# Altium schematic sheet Mach dieu khien dong co dc luu tru.SchDoc
size A4
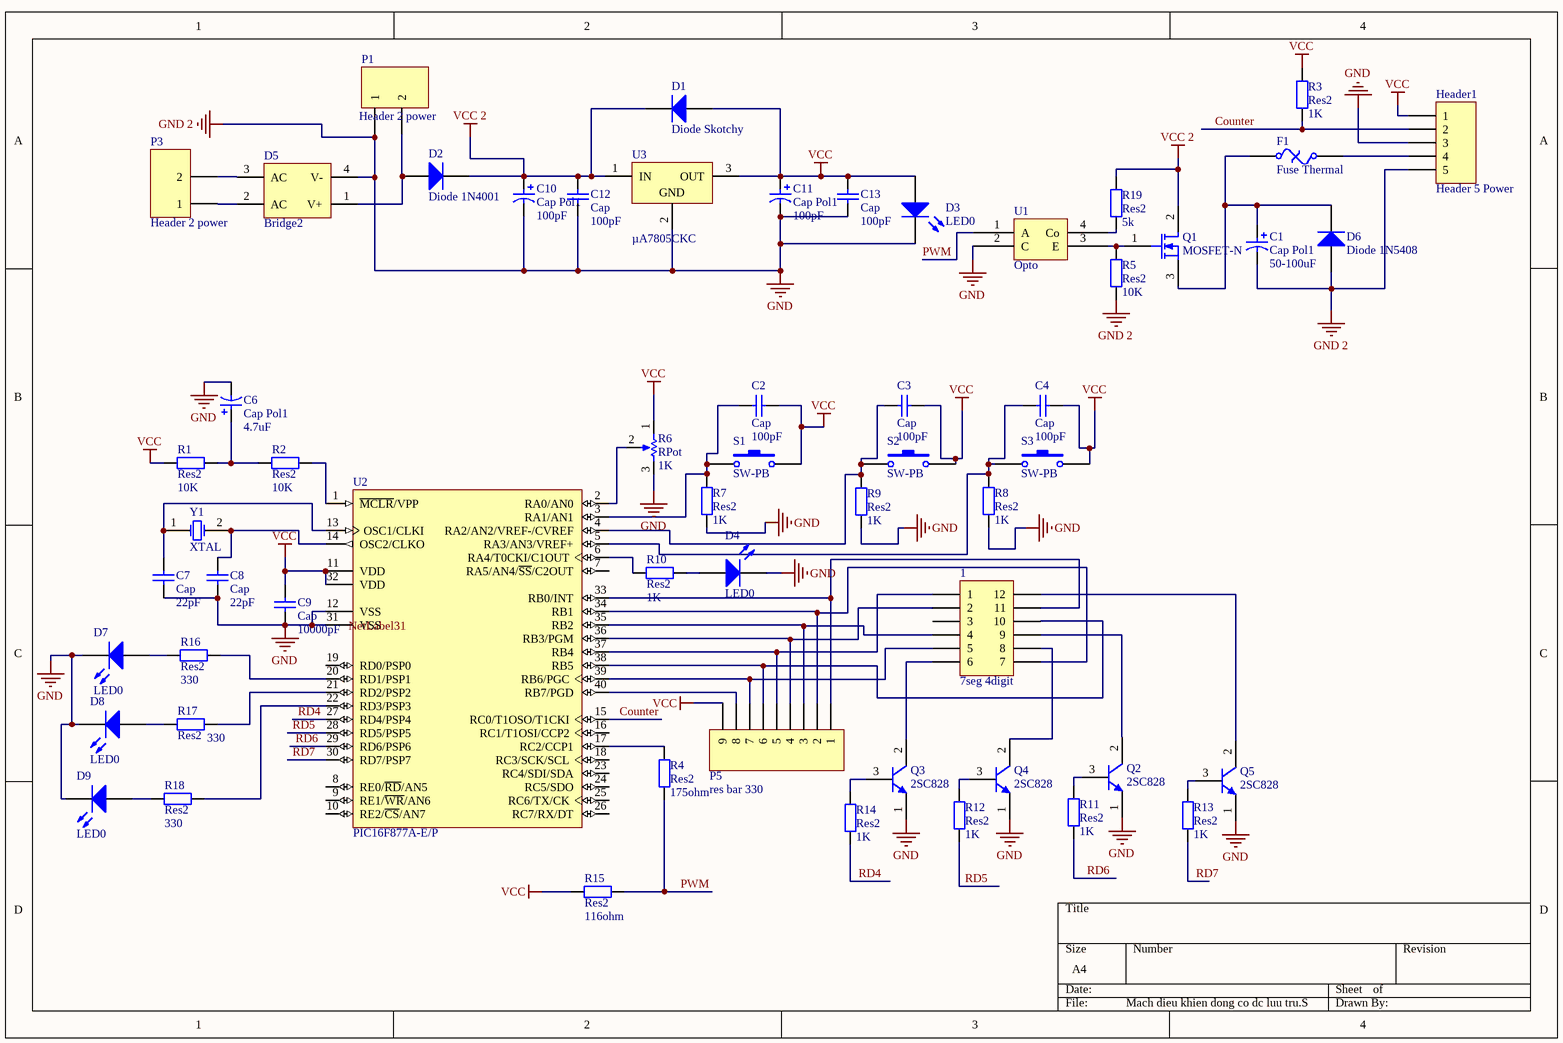
[diagram p0: Mach dieu khien dong co dc luu tru.SchDoc]

## Parts
1  7seg 4digit  [LEDDIP-12/QUAD]
C1  Cap Pol1  value 50-100uF  [CAPPR5-5x7]
C2  Cap  value 100pF  [CAPNTO3.18-4.83x2.67]
C3  Cap  value 100pF  [CAPNTO3.18-4.83x2.67]
C4  Cap  value 100pF  [CAPNTO3.18-4.83x2.67]
C6  Cap Pol1  value 4.7uF  [CAPPR2-5x15]
C7  Cap  value 22pF  [CAPNTO3.18-4.83x2.67]
C8  Cap  value 22pF  [CAPNTO3.18-4.83x2.67]
C9  Cap  value 10000pF  [CAPNTO3.18-4.83x2.67]
C10  Cap Pol1  value 100pF  [CAPPR7.5-18x40]
C11  Cap Pol1  value 100pF  [CAPPR3.5-8x5]
C12  Cap  value 100pF  [CAPNTO3.18-4.83x2.67]
C13  Cap  value 100pF  [CAPNTO3.18-4.83x2.67]
D1  Diode Skotchy  [DO-41]
D2  Diode 1N4001  [DO-41]
D3  LED0  [CAPPR2-5x15]
D4  LED0  [CAPPR2-5x15]
D5  Bridge2  [SIP-P4/A6.8]
D6  Diode 1N5408  [DO-201AD]
D7  LED0  [CAPPR2-5x15]
D8  LED0  [CAPPR2-5x15]
D9  LED0  [CAPPR2-5x15]
F1  Fuse Thermal  [PIN-W2/E2.8]
Header1  Header 5 Power  [Header 5 Power]
P1  Header 2 power  [conector 2x1 power]
P3  Header 2 power  [conector 2x1 power]
P5  res bar 330  [HDR1X9]
Q1  MOSFET-N  [E3-manh]
Q2  2SC828  [TO-92-manh]
Q3  2SC828  [TO-92-manh]
Q4  2SC828  [TO-92-manh]
Q5  2SC828  [TO-92-manh]
R1  Res2  value 10K  [AXIAL-0.4]
R2  Res2  value 10K  [AXIAL-0.4]
R3  Res2  value 1K  [AXIAL-0.4]
R4  Res2  value 175ohm  [AXIAL-0.4]
R5  Res2  value 10K  [AXIAL-0.4]
R6  RPot  value 1K  [Header 3 Power]
R7  Res2  value 1K  [AXIAL-0.4]
R8  Res2  value 1K  [AXIAL-0.4]
R9  Res2  value 1K  [AXIAL-0.4]
R10  Res2  value 1K  [AXIAL-0.4]
R11  Res2  value 1K  [AXIAL-0.4]
R12  Res2  value 1K  [AXIAL-0.4]
R13  Res2  value 1K  [AXIAL-0.4]
R14  Res2  value 1K  [AXIAL-0.4]
R15  Res2  value 116ohm  [AXIAL-0.4]
R16  Res2  value 330  [AXIAL-0.4]
R17  Res2  value 330  [AXIAL-0.4]
R18  Res2  value 330  [AXIAL-0.4]
R19  Res2  value 5k  [AXIAL-0.4]
S1  SW-PB  [Button DIP4]
S2  SW-PB  [Button DIP4]
S3  SW-PB  [Button DIP4]
U1  Opto  [DIP-4]
U2  PIC16F877A-E/P  [PDIP600-40]
U3  µA7805CKC  [SFM-T3/A4.7V]
Y1  XTAL  [CAPR5-4X5]

## Nets
GND: C1.2 C6.2 C7.1 C8.1 C9.1 C10.2 C11.2 C12.1 C13.1 D3.2(K) D4.2(K) D5.4(V-) D6.1(A) D7.2(K) D8.2(K) D9.2(K) Header1.3 Header1.5 P1.1 Q2.1(E) Q3.1(E) Q4.1(E) Q5.1(E) R5.1 R6.3(BOT) R7.1 R8.1 R9.1 U1.2(C) U2.12(VSS) U2.31(VSS) U3.2(GND)  [also labelled GND 2]
VCC: C2.2 C3.2 C4.2 C9.2 C11.1 C13.2 D1.1(A) D3.1(A) Header1.1 P5.9 R1.1 R3.1 R6.1(TOP) R15.2 S1.2 S2.2 S3.2 U2.11(VDD) U2.32(VDD) U3.3(OUT)
VCC 2: C10.1 C12.2 D1.2(K) D2.2(K) Q1.2(D) R19.2 U3.1(IN)
Counter: Header1.2 R3.2 U2.15(RC0/T1OSO/T1CKI)
PWM: R4.1 R15.1 U1.1(A)
RD4: R14.1 U2.27(RD4/PSP4)
RD5: R12.1 U2.28(RD5/PSP5)
RD6: R11.1 U2.29(RD6/PSP6)
RD7: R13.1 U2.30(RD7/PSP7)
Net1_1: 1.1 P5.5 U2.37(RB4)
Net1_2: 1.2 P5.4 U2.36(RB3/PGM)
Net1_4: 1.4 P5.3 U2.35(RB2)
Net1_5: 1.5 P5.7 U2.39(RB6/PGC)
Net1_6: 1.6 Q3.2(C)
Net1_7: 1.7 P5.2 U2.34(RB1)
Net1_8: 1.8 Q4.2(C)
Net1_9: 1.9 Q2.2(C)
Net1_10: 1.10 P5.6 U2.38(RB5)
Net1_11: 1.11 P5.1 U2.33(RB0/INT)
Net1_12: 1.12 Q5.2(C)
NetC1_1: C1.1 D6.2(K) F1.1 Q1.3(S)
NetC2_1: C2.1 R7.2 S1.1 U2.3(RA1/AN1)
NetC3_1: C3.1 R9.2 S2.1 U2.4(RA2/AN2/VREF-/CVREF)
NetC4_1: C4.1 R8.2 S3.1 U2.5(RA3/AN3/VREF+)
NetC6_1: C6.1 R1.2 R2.1
NetC7_2: C7.2 U2.13(OSC1/CLKI) Y1.1(OSC1)
NetC8_2: C8.2 U2.14(OSC2/CLKO) Y1.2(OSC2)
NetD2_1: D2.1(A) D5.1(V+) P1.2
NetD4_1: D4.1(A) R10.2
NetD5_2: D5.2(AC) P3.1
NetD5_3: D5.3(AC) P3.2
NetD7_1: D7.1(A) R16.1
NetD8_1: D8.1(A) R17.1
NetD9_1: D9.1(A) R18.1
NetF1_2: F1.2 Header1.4
NetP5_8: P5.8 U2.40(RB7/PGD)
NetQ1_1: Q1.1(G) R5.2 U1.3(E)
NetQ2_3: Q2.3(B) R11.2
NetQ3_3: Q3.3(B) R14.2
NetQ4_3: Q4.3(B) R12.2
NetQ5_3: Q5.3(B) R13.2
NetR2_2: R2.2 U2.1(~{MCLR}/VPP)
NetR4_2: R4.2 U2.17(RC2/CCP1)
NetR6_2: R6.2(TAP) U2.2(RA0/AN0)
NetR10_1: R10.1 U2.6(RA4/T0CKI/C1OUT)
NetR16_2: R16.2 U2.20(RD1/PSP1)
NetR17_2: R17.2 U2.21(RD2/PSP2)
NetR18_2: R18.2 U2.22(RD3/PSP3)
NetR19_1: R19.1 U1.4(Co)

Not connected (* = marked no-connect by the designer): 1 3; U2 7(RA5/AN4/~{SS}/C2OUT) 8(RE0/~{RD}/AN5) 9(RE1/~{WR}/AN6) 10(RE2/~{CS}/AN7) 16(RC1/T1OSI/CCP2) 18(RC3/SCK/SCL) 19(RD0/PSP0) 23(RC4/SDI/SDA) 24(RC5/SDO) 25(RC6/TX/CK) 26(RC7/RX/DT)

## Notes on the sheet
- Labels drawn without touching a wire or pin: NetLabel31

## Library data of the parts
1 = 7seg 4digit: Header, 6-Pin, Dual row; LatestRevisionDate: 17-Jul-2002; LatestRevisionNote: Re-released for DXP Platform.; Publisher: Altium Limited
C1 C6 C10 C11 = Cap Pol1: Polarized Capacitor (Radial); Published: 8-Jun-2000; LatestRevisionDate: 17-Jul-2002; LatestRevisionNote: Re-released for DXP Platform.; PackageReference: RB7.6-15; Publisher: Altium Limited; PackageDescription: Polarized Capacitor (Radial); 2 Leads
C2-C4 C7-C9 C12 C13 = Cap: Capacitor; Published: 8-Jun-2000; LatestRevisionDate: 17-Jul-2002; LatestRevisionNote: Re-released for DXP Platform.; PackageReference: RAD-0.3; Publisher: Altium Limited; PackageDescription: Radial Cap, Thru-Hole; 2 Leads; 0.3 in Pin Spacing
D1 D2 = Diode 1N4001: 1 Amp General Purpose Rectifier; Published: 8-Jun-2000; LatestRevisionDate: 17-Jul-2002; LatestRevisionNote: Re-released for DXP Platform.; DatasheetVersion: 1998; PackageVersion: Aug-1999; PackageReference: DO-41; Publisher: Altium Limited; PackageDescription: Diode, Axial; Body 5.2 x 2.7 mm (LxDia. max), Lead Dia. 0.86 mm (max); Code_JEDEC: DO-204-AL; ComponentLink1Description: Manufacturer Link; ComponentLink1URL: http://www.fairchildsemi.com/; ComponentLink2Description: Datasheet; ComponentLink2URL: http://www.fairchildsemi.com/ds/1N%2F1N4001.pdf
D3 D4 D7-D9 = LED0: Typical INFRARED GaAs LED; Published: 8-Jun-2000; LatestRevisionDate: 08-Jul-2005; LatestRevisionNote: Mech Layer 1 removed.; PackageReference: LED-0; Publisher: Altium Limited; PackageDescription: LED; 2 Leads
D5 = Bridge2: Diode Bridge; Published: 24-Mar-1999; LatestRevisionDate: 17-Jul-2002; LatestRevisionNote: Re-released for DXP Platform.; PackageReference: D-46_6A; Publisher: Altium Limited; PackageDescription: Bridge Rectifier; 4 Terminals; Body 16.8 x 16.8 mm (typ); Pitch 10.67 mm
D6 = Diode 1N5408: 3 Amp Medium Power Silicon Rectifier Diode; Published: 8-Jun-2000; LatestRevisionDate: 17-Jul-2002; LatestRevisionNote: Re-released for DXP Platform.; DatasheetVersion: Aug-1984; PackageReference: DO-201AD; Publisher: Altium Limited; PackageDescription: Diode, Axial; Body 9.5 x 5.3 mm (LxDia. max), Lead Dia. 1.32 mm (max); ComponentLink1Description: Manufacturer Link; ComponentLink1URL: http://www.irf.com/
F1 = Fuse Thermal: Thermal Fuse; Published: 24-Mar-1999; LatestRevisionDate: 17-Jul-2002; LatestRevisionNote: Re-released for DXP Platform.; PackageReference: PIN-W2/E2.8; Publisher: Altium Limited; PackageDescription: Thru-Hole; 2 Leads
P1 = Header 2 power: Header, 4-Pin, Right Angle; LatestRevisionDate: 17-Jul-2002; LatestRevisionNote: Re-released for DXP Platform.; Publisher: Altium Limited
P3 = Header 2 power: Header, 2-Pin, Right Angle; LatestRevisionDate: 17-Jul-2002; LatestRevisionNote: Re-released for DXP Platform.; Publisher: Altium Limited
P5 = Header 9: Header, 9-Pin; LatestRevisionDate: 17-Jul-2002; LatestRevisionNote: Re-released for DXP Platform.; Publisher: Altium Limited
Q1 = MOSFET-N: N-Channel MOSFET; Published: 8-Jun-2000; LatestRevisionDate: 17-Jul-2002; LatestRevisionNote: Re-released for DXP Platform.; PackageVersion: 1995/1996; PackageReference: E3; Publisher: Altium Limited; PackageDescription: TO, Flat Index; 3 In-Line, Axial Leads; Body Dia. 4.6mm; Lead Dia. 0.5 mm (max)
Q2-Q5 = 2SC828: NPN General Purpose Amplifier; Published: 8-Jun-2000; LatestRevisionDate: 15-Jan-2003; LatestRevisionNote: PCB Footprint 'BCY-W3/D4.7' replaced; DatasheetVersion: 1997; PackageVersion: Sep-1998; PackageReference: TO-92A; Publisher: Altium Limited; PackageDescription: TO, Flat Index; 3 In-Line, Axial Leads; Body Dia. 4.5mm; Leads 0.51 x 0.48 mm (max); ComponentLink1Description: Manufacturer Link; ComponentLink1URL: http://www.fairchildsemi.com/; ComponentLink2Description: Datasheet; ComponentLink2URL: http://www.fairchildsemi.com/ds/2N%2F2N3904.pdf
R1-R5 R7-R19 = Res2: Resistor; Published: 8-Jun-2000; LatestRevisionDate: 17-Jul-2002; LatestRevisionNote: Re-released for DXP Platform.; PackageReference: AXIAL-0.4; Publisher: Altium Limited; PackageDescription: Axial Device, Thru-Hole; 2 Leads; 0.4 in Pin Spacing
R6 = RPot: Potentiometer; Sim Note: Enter the Resistance value and the set point into parameter fields.; Set Position: 0.5; Published: 8-Jun-2000; LatestRevisionDate: 17-Jul-2002; LatestRevisionNote: Re-released for DXP Platform.; PackageReference: VR5; Publisher: Altium Limited; PackageDescription: Variable Resistor, Thru-Hole; 3 Leads
S1-S3 = SW-PB: Switch; Published: 24-Mar-1999; LatestRevisionDate: 17-Jul-2002; LatestRevisionNote: Re-released for DXP Platform.; PackageReference: SPST-2; Publisher: Altium Limited; PackageDescription: Switch; 2 Leads
U1 = Opto 1
U2 = PIC16F877A-E/P: Enhanced FLASH Microcontroller, 8K (x14-Bit words) FLASH, 368 Bytes RAM, 40-Pin PDIP, Standard VDD Range, Extended Temperature; ComponentAvailability: Unknown. Contact manufacturer to determine status.; Published: 11-Oct-2004; LatestRevisionDate: 29-Jan-2009; LatestRevisionNote: Sch. layout revised. 3D Model Removed.; DatasheetVersion: revB, Oct-2003; PackageVersion: revBB, Aug-2009; PackageReference: PDIP600-P40; Publisher: Altium Limited; PackageDescription: 40-Lead Plastic Dual In-Line (P) - 600 mil Body [PDIP]; Supplier 1: Digi-Key; Supplier Part Number 1: PIC16F877A-E/P-ND; Supplier 2: Farnell; Supplier Part Number 2: 1567990; ComponentLink1Description: Datasheet; ComponentLink1URL: http://ww1.microchip.com/downloads/en/DeviceDoc/39582b.pdf; ComponentLink2Description: Packaging Specification; ComponentLink2URL: http://www.microchip.com/stellent/groups/techpub_sg/documents/packagingspec/en012702.pdf; ComponentLink3Description: Microchip.com Home; ComponentLink3URL: http://www.microchip.com/
U3 = µA7805CKC: Positive-Voltage Regulator; Manufacturer: Texas Instruments; Package Information: Latest Revision: Sep-1995; Class I: Power Management; Note: Pin 2 is electrically connected to TAB.; Published: 15-Apr-2002; Datasheet: Latest Revision: Jul-1999; Package Reference: KC03; Publisher: Altium Limited; Class II: Voltage Regulator
Y1 = XTAL: Crystal Oscillator; Published: 8-Jun-2000; LatestRevisionDate: 17-Jul-2002; LatestRevisionNote: Re-released for DXP Platform.; PackageReference: R38; Publisher: Altium Limited; PackageDescription: Crystal, Thru-Hole; 2 Leads; Body 3.1 x 8.2 mm (Dia.xH)
Header1 = Header 5 Power: LatestRevisionDate: 17-Jul-2002; LatestRevisionNote: Re-released for DXP Platform.; Publisher: Altium Limited